# EAGLE design g_plus_shield_v1 (EAGLE 7.2.0)
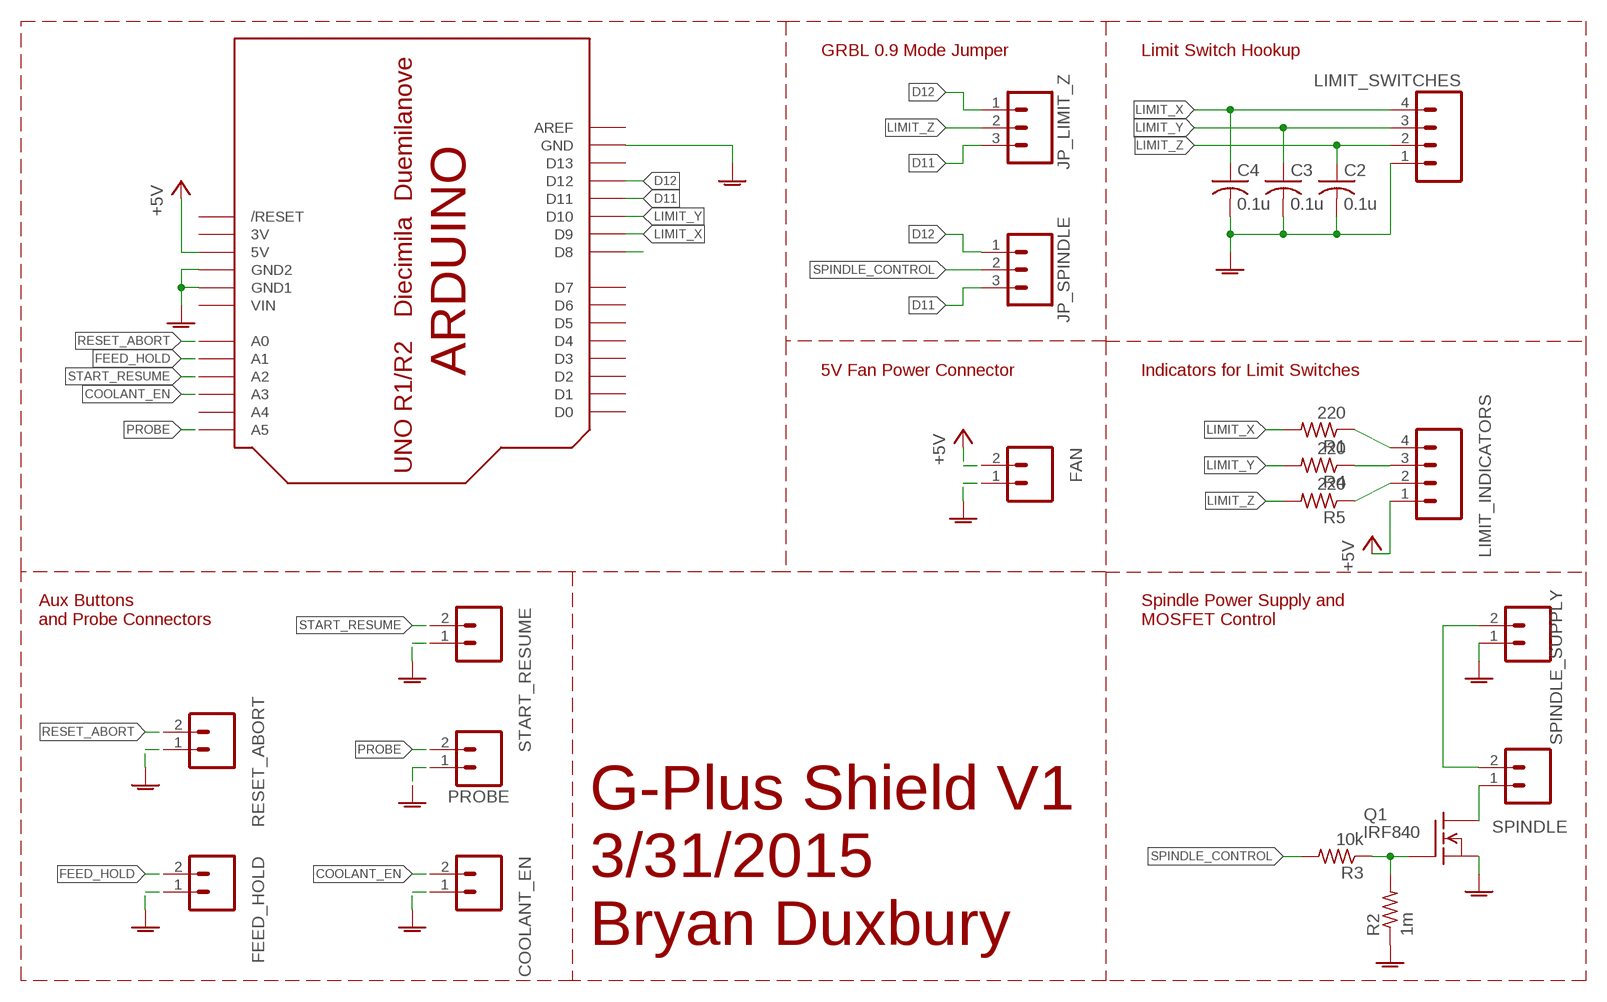
[diagram p0: schematic, sheet 1]

## Parts
C2  0.1u  C-USC0805K  [C0805K]
C3  0.1u  C-USC0805K  [C0805K]
C4  0.1u  C-USC0805K  [C0805K]
COOLANT_EN  M02POLAR  [MOLEX-1X2]
FAN  M02POLAR  [MOLEX-1X2]
FEED_HOLD  M02POLAR  [MOLEX-1X2]
JP_LIMIT_Z  M03POLAR  [MOLEX-1X3]
JP_SPINDLE  M03POLAR  [MOLEX-1X3]
LIMIT_INDICATORS  M04POLAR  [MOLEX-1X4]
LIMIT_SWITCHES  M04POLAR  [MOLEX-1X4]
PROBE  M02POLAR  [MOLEX-1X2]
Q1  IRF840  [TO220]
R1  220  R-US_M0805  [M0805]
R2  1m  R-US_M0805  [M0805]
R3  10k  R-US_M0805  [M0805]
R4  220  R-US_M0805  [M0805]
R5  220  R-US_M0805  [M0805]
RESET_ABORT  M02POLAR  [MOLEX-1X2]
SPINDLE  M02POLAR  [MOLEX-1X2]
SPINDLE_SUPPLY  M02POLAR  [MOLEX-1X2]
START_RESUME  M02POLAR  [MOLEX-1X2]
U$1  ARDUINO-NODIM  [ARDUINO-NODIM]

## Nets
48V: SPINDLE.2 SPINDLE_SUPPLY.2
+5V: FAN.2 LIMIT_INDICATORS.1 U$1.5V
COOLANT_EN: COOLANT_EN.2 U$1.A3
D11: JP_LIMIT_Z.3 JP_SPINDLE.3 U$1.D11
D12: JP_LIMIT_Z.1 JP_SPINDLE.1 U$1.D12
FEED_HOLD: FEED_HOLD.2 U$1.A1
GNDA: C2.2 C3.2 C4.2 COOLANT_EN.1 FAN.1 FEED_HOLD.1 LIMIT_SWITCHES.1 PROBE.1 Q1.3(S) R2.1 RESET_ABORT.1 SPINDLE_SUPPLY.1 START_RESUME.1 U$1.GND U$1.GND1 U$1.GND2
LIMIT_X: C4.1 LIMIT_SWITCHES.4 R1.2 U$1.D9
LIMIT_Y: C3.1 LIMIT_SWITCHES.3 R4.2 U$1.D10
LIMIT_Z: C2.1 JP_LIMIT_Z.2 LIMIT_SWITCHES.2 R5.2
N$1: LIMIT_INDICATORS.4 R1.1
N$2: Q1.2(D) SPINDLE.1
N$3: Q1.1(G) R2.2 R3.1
N$4: LIMIT_INDICATORS.2 R5.1
N$5: LIMIT_INDICATORS.3 R4.1
N$9: U$1.D8
PROBE: PROBE.2 U$1.A5
RESET_ABORT: RESET_ABORT.2 U$1.A0
SPINDLE_CONTROL: JP_SPINDLE.2 R3.2
START_RESUME: START_RESUME.2 U$1.A2
Unconnected: U$1.A4 U$1.AREF U$1.D0 U$1.D1 U$1.D2 U$1.D3 U$1.D4 U$1.D5 U$1.D6 U$1.D7 U$1.D13 U$1.RESET(/RESET)

## Notes on the sheet
- GRBL 0.9 Mode Jumper | Limit Switch Hookup
- 5V Fan Power Connector | Indicators for Limit Switches
- Aux Buttons 
  and Probe Connectors
- Spindle Power Supply and 
  MOSFET Control
- G-Plus Shield V1
  3/31/2015
  Bryan Duxbury

## Power pins joined to a net without a drawn wire
3V: U$1.3V
VIN: U$1.VIN

## Library data of the parts
C2-C4 = rcl:C-US: CAPACITOR, American symbol
COOLANT_EN FAN FEED_HOLD PROBE RESET_ABORT SPINDLE SPINDLE_SUPPLY START_RESUME = SparkFun-Connectors:M02: Standard 2-pin 0.1" header. Use with - straight break away headers ( PRT-00116) - right angle break away headers (PRT-00553) - swiss pins (PRT-00743) - machine pins (PRT-00117) - female headers (PRT-00115) Molex polarized connector foot print use with: PRT-08233 with associated crimp pins and housings. 2.54_SCREWTERM for use with PRT-10571. 3.5mm Screw Terminal footprints for PRT-08084 5mm Screw Terminal footprints for use with PRT-08433
JP_LIMIT_Z JP_SPINDLE = SparkFun-Connectors:M03: Header 3 Standard 3-pin 0.1" header. Use with straight break away headers (SKU : PRT-00116), right angle break away headers (PRT-00553), swiss pins (PRT-00743), machine pins (PRT-00117), and female headers (PRT-00115). Molex polarized connector foot print use with SKU : PRT-08232 with associated crimp pins and housings.
LIMIT_INDICATORS LIMIT_SWITCHES = SparkFun-Connectors:M04: Header 4 Standard 4-pin 0.1" header. Use with straight break away headers (SKU : PRT-00116), right angle break away headers (PRT-00553), swiss pins (PRT-00743), machine pins (PRT-00117), and female headers (PRT-00115). Molex polarized connector foot print use with SKU : PRT-08231 with associated crimp pins and housings. 1MM SMD Version SKU: PRT-10208
Q1 = transistor-fet:IRF840: N-Channel Enhancement MOSFET (HEXFET); 500V; 8A; 0,85Ohm
R1-R5 = rcl:R-US_: RESISTOR, American symbol
U$1 = adafruit:ARDUINO: Arduino Diecimila/Duemilanove Make a shield with ease, this package has all the named pins as well as the two mounting drill holes and an outline of the USB and DC power connector. The outline is on the DIMENSION layer, so if your board house uses it they will cut the outline to match. http://www.ladyada.net/library/pcb/eaglelibrary.html

## Board
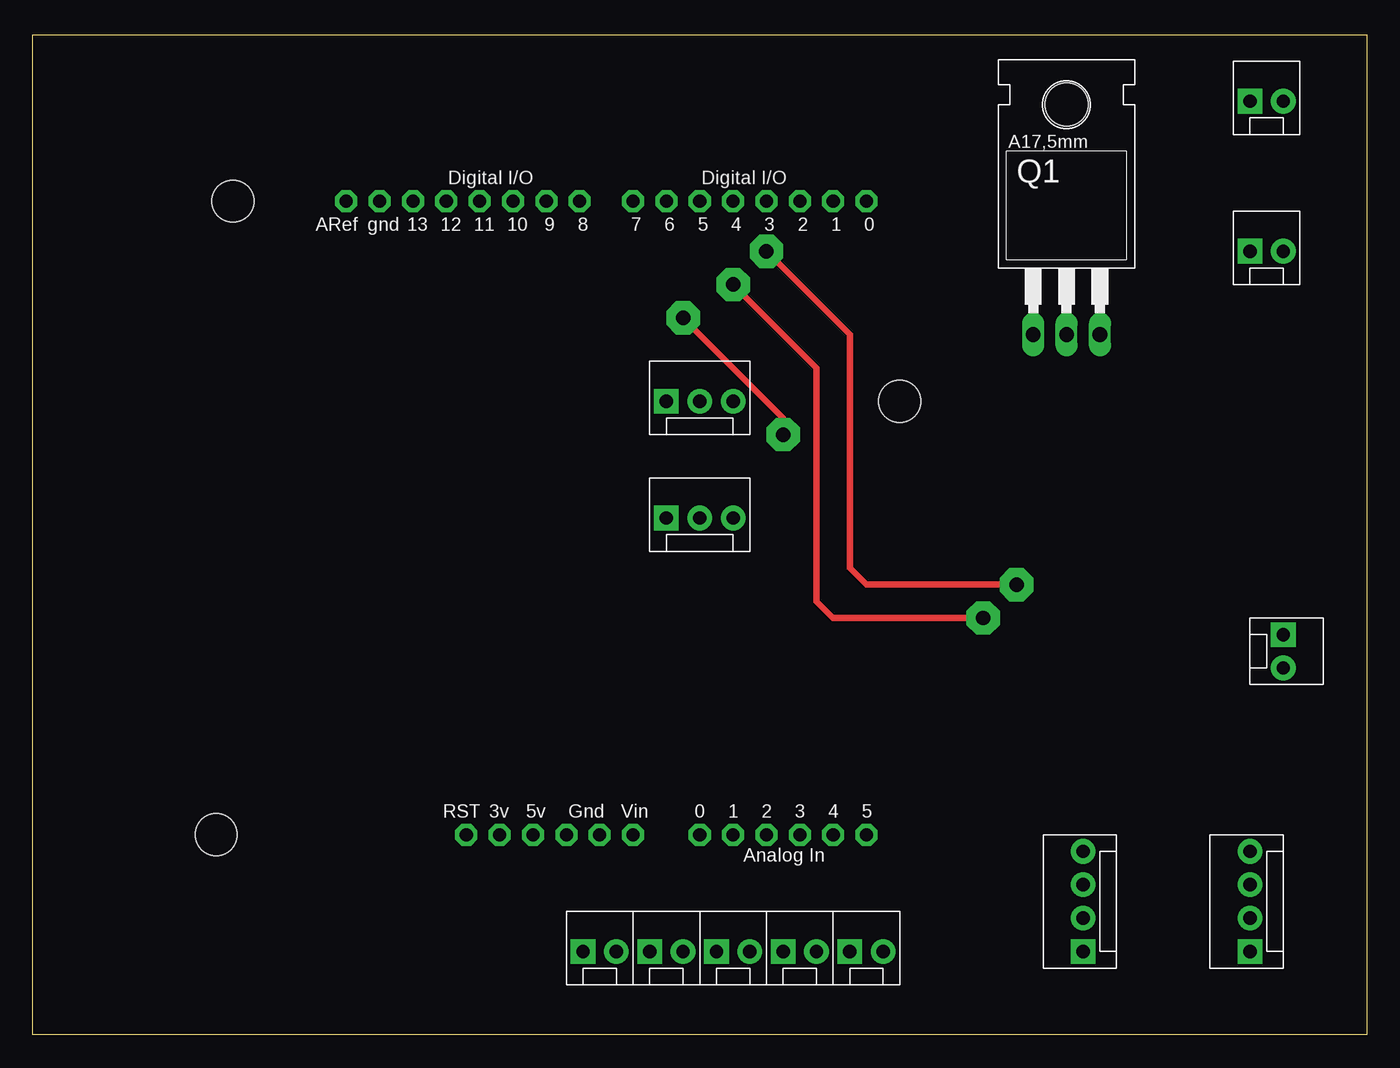
[diagram p1: board, top side]
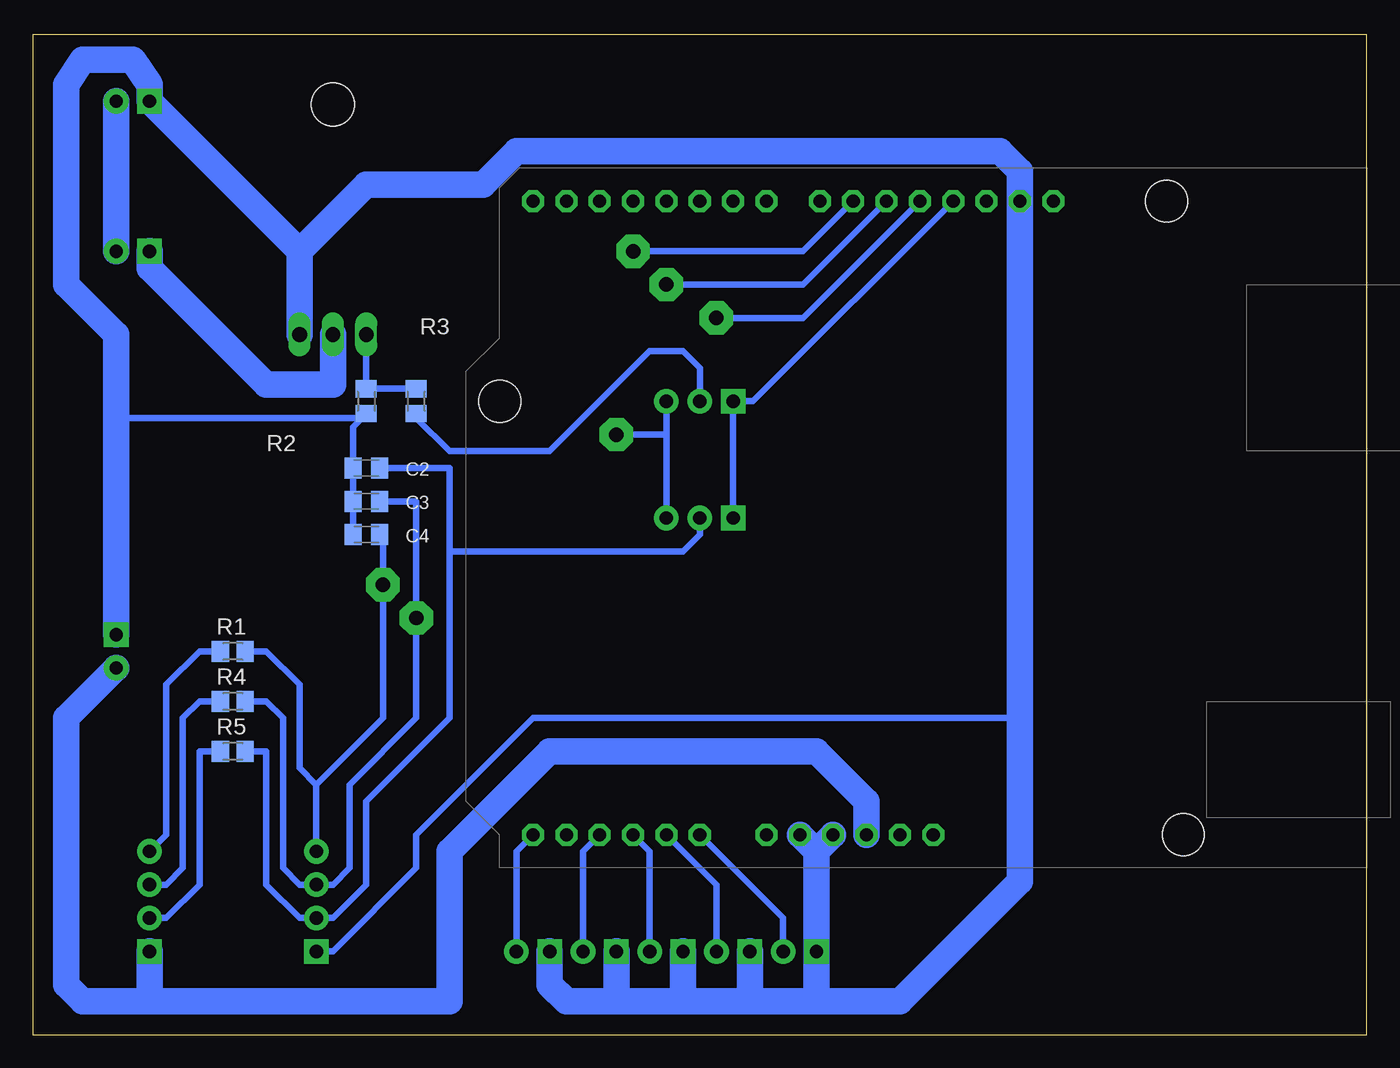
[diagram p2: board, bottom side, seen from below]

Size 101.6 x 76.2 mm. Coordinates in mm from the lower left corner, seen from the top.
Outline: 0,0 0,76.2 101.6,76.2 101.6,0 0,0
Copper layers (1*16): Top 0.035mm / dielectric 1.5mm / Bottom 0.035mm
Design rules "default *": minimum track width 20mil, minimum drill 24mil, track to track 20mil, track to pad 20mil, pad to pad 20mil, via to via 20mil, smd to smd 20mil, copper to edge 20mil, drill to drill 20mil, minimum pad ring 10mil, minimum via ring 8mil, stop-mask expansion 4mil, vias tented up to drill 0mil, thermal gap 10mil

### Footprints (pad centres in the part's own frame; a part is rotated, then mirrored left to right if it is on the bottom)
C0805K = smd 1.3 x 1.6: 1 -1,0; 2 1,0
MOLEX-1X2 = drill 1.016 pad 1.88 square: 1 0,0 | drill 1.016 pad 1.88: 2 2.54,0
MOLEX-1X3 = drill 1.016 pad 1.88 square: 1 0,0 | drill 1.016 pad 1.88: 2 2.54,0; 3 5.08,0
MOLEX-1X4 = drill 1.016 pad 1.88 square: 1 0,0 | drill 1.016 pad 1.88: 2 2.54,0; 3 5.08,0; 4 7.62,0
TO220 = drill 1.118 long: 1 -2.54,-6.35; 2 0,-6.35; 3 2.54,-6.35 | hole 3.302: 0,11.176
M0805 = smd 1.3 x 1.6: 1 -0.95,0; 2 0.95,0
ARDUINO-NODIM = drill 1 pad 1.676 octagon: 3V 35.56,2.54; 5V 38.1,2.54; A0 50.8,2.54; A1 53.34,2.54; A2 55.88,2.54; A3 58.42,2.54; A4 60.96,2.54; A5 63.5,2.54; AREF 23.876,50.8; D0 63.5,50.8; D1 60.96,50.8; D2 58.42,50.8; D3 55.88,50.8; D4 53.34,50.8; D5 50.8,50.8; D6 48.26,50.8; D7 45.72,50.8; D8 41.656,50.8; D9 39.116,50.8; D10 36.576,50.8; D11 34.036,50.8; D12 31.496,50.8; D13 28.956,50.8; GND 26.416,50.8; GND1 43.18,2.54; GND2 40.64,2.54; RESET 33.02,2.54; VIN 45.72,2.54 | hole 3.2: 15.24,50.8; 66.04,35.56; 13.97,2.54

### Placement (x,y rotation side)
C2  76.2,43.18 180 bottom
C3  76.2,40.64 180 bottom
C4  76.2,38.1 180 bottom
COOLANT_EN  57.15,6.35 0 top
FAN  95.25,30.48 270 top
FEED_HOLD  46.99,6.35 0 top
JP_LIMIT_Z  48.26,39.37 0 top
JP_SPINDLE  48.26,48.26 0 top
LIMIT_INDICATORS  92.71,6.35 90 top
LIMIT_SWITCHES  80.01,6.35 90 top
PROBE  62.23,6.35 0 top
Q1  78.74,59.69 0 top
R1  86.36,29.21 0 bottom
R2  76.2,48.26 90 bottom
R3  72.39,48.26 270 bottom
R4  86.36,25.4 0 bottom
R5  86.36,21.59 0 bottom
RESET_ABORT  41.91,6.35 0 top
SPINDLE  92.71,59.69 0 top
SPINDLE_SUPPLY  92.71,71.12 0 top
START_RESUME  52.07,6.35 0 top
U$1  0,12.7 0 top

### Tracks (layer width: path | path; a pad name or v marks a point on that pad's centre or on a via)
48V
  Bottom 2.032: SPINDLE_SUPPLY.2 SPINDLE.2
+5V
  Bottom 2.032: FAN.2 99.06,24.13 99.06,3.81 97.79,2.54 92.71,2.54 | U$1.5V 38.1,17.78 41.91,21.59 62.23,21.59 69.85,13.97 69.85,2.54 92.71,2.54 | LIMIT_INDICATORS.1 92.71,2.54
COOLANT_EN
  Bottom 0.508: U$1.A3 59.69,13.97 COOLANT_EN.2
D11  (via drill 1.1 pad 2.54)
  Top 0.508: v49.53,54.61 57.15,46.99 v57.15,45.72
  Bottom 0.508: JP_SPINDLE.3 53.34,45.72 | 53.34,45.72 JP_LIMIT_Z.3 | U$1.D11 42.93,54.61 v49.53,54.61 | v57.15,45.72 53.34,45.72
D12
  Bottom 0.508: JP_LIMIT_Z.1 JP_SPINDLE.1 46.74,48.26 U$1.D12
FEED_HOLD
  Bottom 0.508: U$1.A1 49.53,11.43 FEED_HOLD.2
GNDA
  Bottom 0.508: LIMIT_SWITCHES.1 78.74,6.35 72.39,12.7 72.39,15.24 63.5,24.13 26.42,24.13 | C4.2 C3.2 C2.2 77.2,46.31 R2.1 76.52,46.99 95.25,46.99
  Bottom 2.032: 81.28,59.69 SPINDLE_SUPPLY.1 92.71,72.39 93.98,74.3 97.79,74.3 99.06,72.39 99.06,57.15 95.25,53.34 95.25,46.99 FAN.1 | 41.91,2.54 35.56,2.54 26.42,11.68 26.42,24.13 U$1.GND 26.42,65.79 27.94,67.31 64.77,67.31 67.31,64.77 76.2,64.77 81.28,59.69 | 41.91,2.54 46.99,2.54 | 46.99,2.54 52.07,2.54 | 52.07,2.54 57.15,2.54 | 57.15,2.54 60.96,2.54 62.23,3.81 PROBE.1 | 41.91,2.54 RESET_ABORT.1 41.91,13.97 | FEED_HOLD.1 46.99,2.54 | START_RESUME.1 52.07,2.54 | COOLANT_EN.1 57.15,2.54 | Q1.3 81.28,59.69 | 41.91,13.97 U$1.GND2 | U$1.GND1 41.91,13.97
LIMIT_X  (via drill 1.1 pad 2.54)
  Top 0.508: v55.88,59.69 62.23,53.34 62.23,35.56 63.5,34.29 v74.93,34.29
  Bottom 0.508: U$1.D9 42.93,59.69 v55.88,59.69 | C4.1 74.93,37.83 v74.93,34.29 74.93,24.13 80.01,19.05 | 80.01,19.05 LIMIT_SWITCHES.4 | 80.01,19.05 81.28,20.32 81.28,26.67 83.82,29.21 R1.2
LIMIT_Y  (via drill 1.1 pad 2.54)
  Top 0.508: v53.34,57.15 59.69,50.8 59.69,33.02 60.96,31.75 v72.39,31.75
  Bottom 0.508: C3.1 72.39,40.64 v72.39,31.75 72.39,24.13 77.47,19.05 77.47,12.7 78.74,11.43 LIMIT_SWITCHES.3 81.28,11.43 82.55,12.7 82.55,24.13 83.82,25.4 R4.2 | U$1.D10 42.93,57.15 v53.34,57.15
LIMIT_Z
  Bottom 0.508: C2.1 69.85,43.18 69.85,36.83 | 69.85,36.83 69.85,24.13 76.2,17.78 76.2,11.43 78.74,8.89 LIMIT_SWITCHES.2 81.28,8.89 83.82,11.43 83.82,21.59 R5.2 | JP_LIMIT_Z.2 50.8,38.1 52.07,36.83 69.85,36.83
N$1
  Bottom 0.508: R1.1 88.9,29.21 91.44,26.67 91.44,15.24 LIMIT_INDICATORS.4
N$2
  Bottom 2.032: Q1.2 78.74,49.53 83.82,49.53 92.71,58.42 SPINDLE.1
N$3
  Bottom 0.508: Q1.1 R2.2 R3.1
N$4
  Bottom 0.508: R5.1 88.9,21.59 88.9,11.43 91.44,8.89 LIMIT_INDICATORS.2
N$5
  Bottom 0.508: R4.1 88.9,25.4 90.17,24.13 90.17,12.7 91.44,11.43 LIMIT_INDICATORS.3
PROBE
  Bottom 0.508: U$1.A5 64.77,13.97 PROBE.2
RESET_ABORT
  Bottom 0.508: U$1.A0 44.45,8.89 RESET_ABORT.2
SPINDLE_CONTROL
  Bottom 0.508: JP_SPINDLE.2 50.8,50.8 52.07,52.07 54.61,52.07 62.23,44.45 69.85,44.45 72.39,46.99 R3.2
START_RESUME
  Bottom 0.508: U$1.A2 54.61,13.97 START_RESUME.2